# EAGLE design XJK1310-BT (EAGLE 9.6.2)
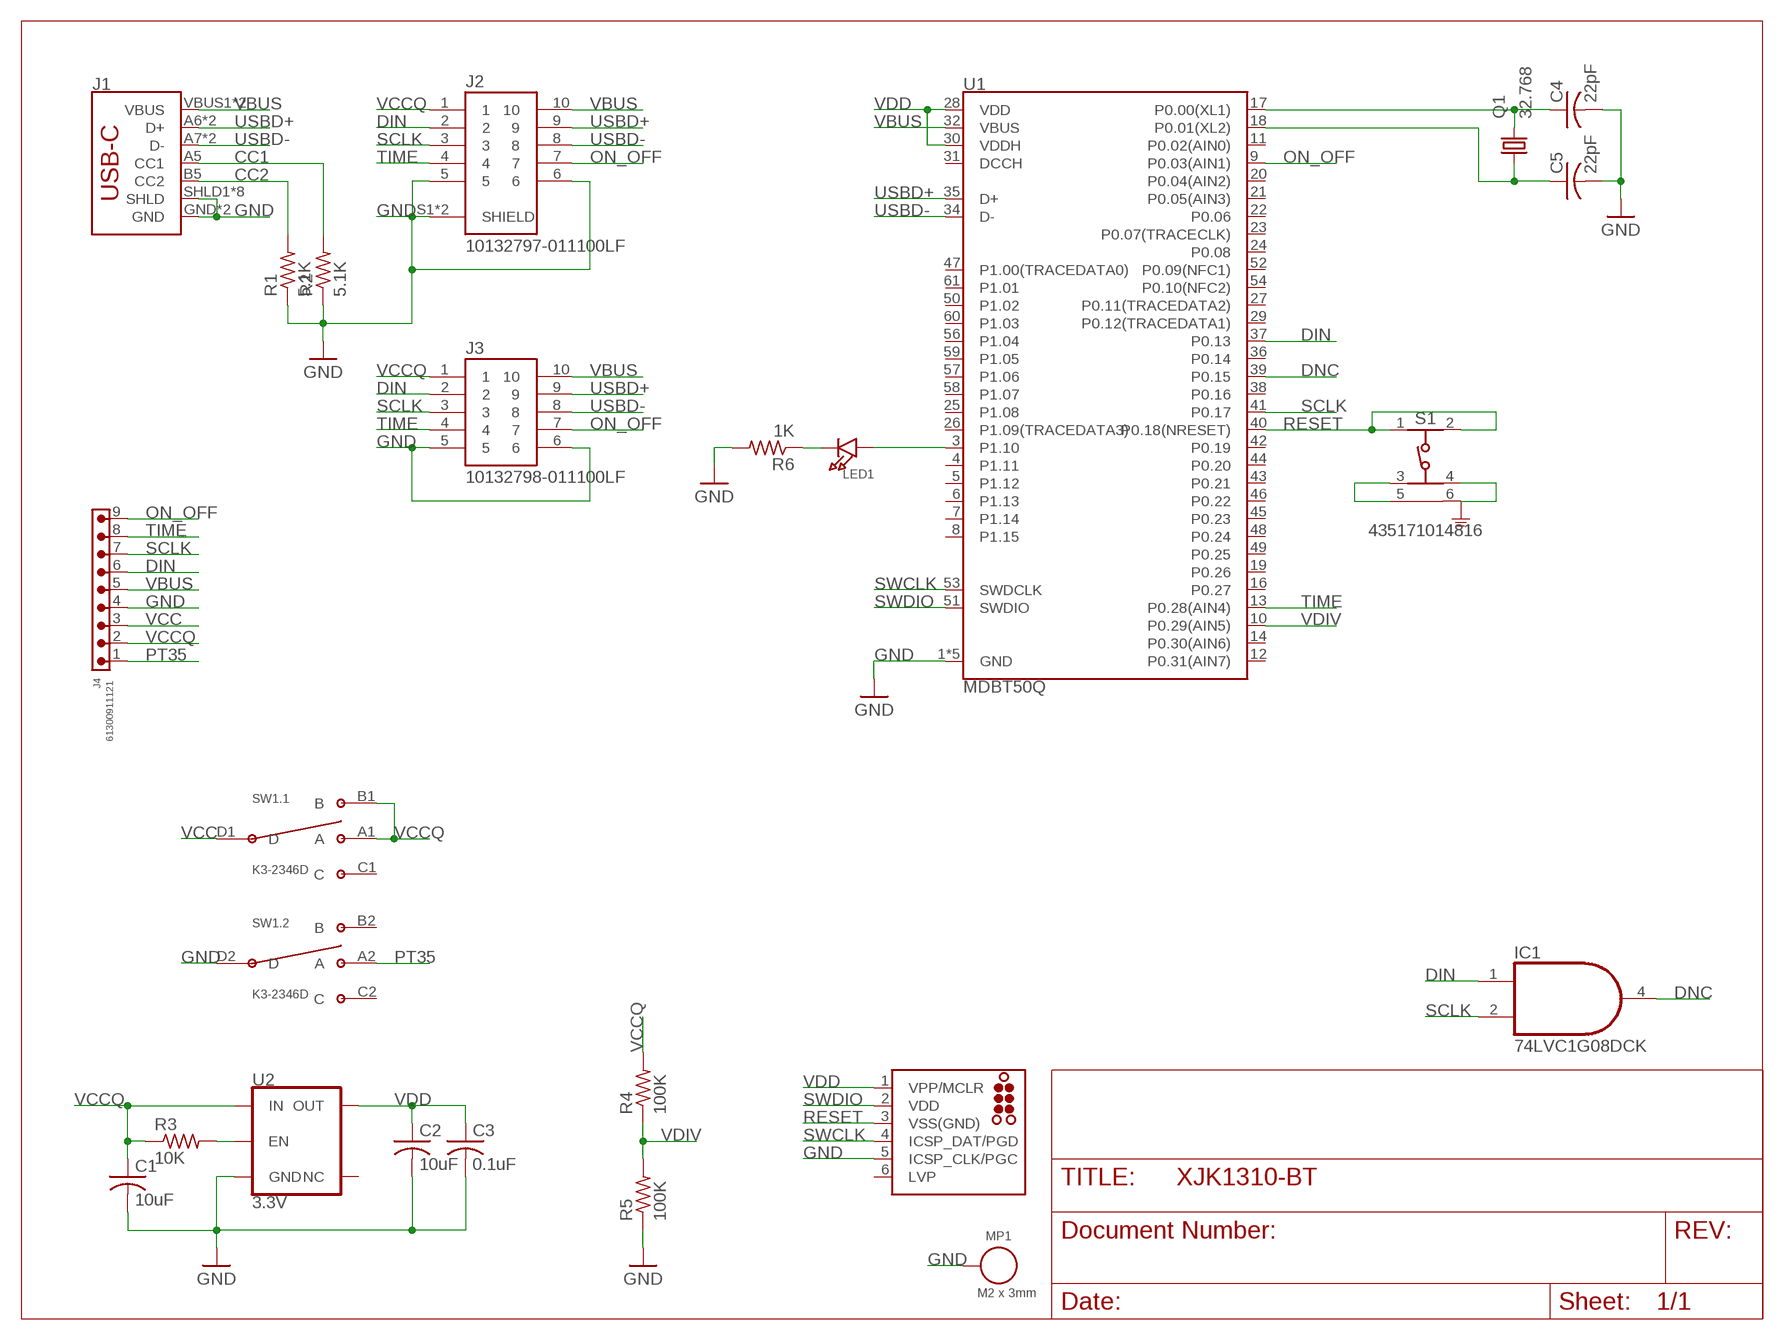
[diagram p0: schematic, sheet 1]

## Parts
C1  10uF  C-USC0603  [C0603]
C2  10uF  C-USC0603  [C0603]
C3  0.1uF  C-USC0603  [C0603]
C4  22pF  C-USC0402  [C0402]
C5  22pF  C-USC0402  [C0402]
IC1  74LVC1G08DCK  [SC70-5]
J1  USB_C5  [USB-C-16P-5]
J2  10132797-011100LF  [AMPHENOL_10132797-011100LF]
J3  10132798-011100LF  [AMPHENOL_10132798-011100LF]
J4  61300911121  6130XX11121_61300911121  [61300911121]
J5  TC2030-MCP-NL  [TC2030-MCP-NL]
LED1  LED0805_NOOUTLINE  [CHIPLED_0805_NOOUTLINE]
MP1  M2 x 3mm  WA-SMSI_9774XXX243_9774030243R  [WA-SMSI_9774030243]
Q1  32.768  KX-327-NHF  [3.2X1.5]
R1  5.1K  R-US_R0402  [R0402]
R2  5.1K  R-US_R0402  [R0402]
R3  10K  R-US_R0402  [R0402]
R4  100K  R-US_R0402  [R0402]
R5  100K  R-US_R0402  [R0402]
R6  1K  R-US_R0402  [R0402]
S1  435171014816  [435171014816]
SW1  K3-2346D  [K3-2346D]
U1  MDBT50Q  [MDBT50Q]
U2  3.3V  V_REG_AP2112K-3.3V  [SOT23-5]

## Nets
CC1: J1.A5(CC1) R2.2
CC2: J1.B5(CC2) R1.2
DIN: IC1.1(I0) J2.2 J3.2 J4.6 U1.37(P0.13)
DNC: IC1.4(O) U1.39(P0.15)
GND: C1.2 C2.2 C3.2 C4.2 C5.2 J1.GND J1.GND2(GND) J1.SHLD1(SHLD) J1.SHLD2(SHLD) J1.SHLD3(SHLD) J1.SHLD4(SHLD) J1.SHLD5(SHLD) J1.SHLD6(SHLD) J1.SHLD7(SHLD) J1.SHLD8(SHLD) J2.5 J2.6 J2.S1(SHIELD) J2.S2(SHIELD) J3.5 J3.6 J4.4 J5.5(ICSP_CLK/PGC) MP1.1 R1.1 R2.1 R5.1 R6.2 S1.3 S1.4 S1.5 S1.6 SW1.D2(.2:D) U1.1(GND) U1.2(GND) U1.15(GND) U1.33(GND) U1.55(GND) U2.2(GND)
N$1: C4.1 Q1.2 U1.17(P0.00(XL1))
N$2: C5.1 Q1.1 U1.18(P0.01(XL2))
N$3: R3.2 U2.3(EN)
N$4: LED1.A U1.3(P1.10)
N$6: LED1.C R6.1
ON_OFF: J2.7 J3.7 J4.9 U1.9(P0.03(AIN1))
PT35: J4.1 SW1.A2(.2:A)
RESET: J5.3(VSS(GND)) S1.1 S1.2 U1.40(P0.18(NRESET))
SCLK: IC1.2(I1) J2.3 J3.3 J4.7 U1.41(P0.17)
SWCLK: J5.4(ICSP_DAT/PGD) U1.53(SWDCLK)
SWDIO: J5.2(VDD) U1.51(SWDIO)
TIME: J2.4 J3.4 J4.8 U1.13(P0.28(AIN4))
USBD+: J1.A6(D+) J1.B6(D+) J2.9 J3.9 U1.35(D+)
USBD-: J1.A7(D-) J1.B7(D-) J2.8 J3.8 U1.34(D-)
VBUS: J1.VBUS1(VBUS) J1.VBUS2(VBUS) J2.10 J3.10 J4.5 U1.32(VBUS)
VCC: J4.3 SW1.D1(.1:D)
VCCQ: C1.1 J2.1 J3.1 J4.2 R3.1 R4.2 SW1.A1(.1:A) SW1.B1(.1:B) U2.1(IN)
VDD: C2.1 C3.1 J5.1(VPP/MCLR) U1.28(VDD) U1.30(VDDH) U2.5(OUT)
VDIV: R4.1 R5.2 U1.10(P0.29(AIN5))
Unconnected: J5.6(LVP) SW1.B2(.2:B) SW1.C1(.1:C) SW1.C2(.2:C) U1.4(P1.11) U1.5(P1.12) U1.6(P1.13) U1.7(P1.14) U1.8(P1.15) U1.11(P0.02(AIN0)) U1.12(P0.31(AIN7)) U1.14(P0.30(AIN6)) U1.16(P0.27) U1.19(P0.26) U1.20(P0.04(AIN2)) U1.21(P0.05(AIN3)) U1.22(P0.06) U1.23(P0.07(TRACECLK)) U1.24(P0.08) U1.25(P1.08) U1.26(P1.09(TRACEDATA3)) U1.27(P0.11(TRACEDATA2)) U1.29(P0.12(TRACEDATA1)) U1.31(DCCH) U1.36(P0.14) U1.38(P0.16) U1.42(P0.19) U1.43(P0.21) U1.44(P0.20) U1.45(P0.23) U1.46(P0.22) U1.47(P1.00(TRACEDATA0)) U1.48(P0.24) U1.49(P0.25) U1.50(P1.02) U1.52(P0.09(NFC1)) U1.54(P0.10(NFC2)) U1.56(P1.04) U1.57(P1.06) U1.58(P1.07) U1.59(P1.05) U1.60(P1.03) U1.61(P1.01) U2.4(NC)

## Power pins joined to a net without a drawn wire
GND: IC1.3(GND)
VCC: IC1.5(VCC)

## Library data of the parts
C1 C2 = rcl:C-US: CAPACITOR, American symbol; LCSC: C86275; SPICEPREFIX: C
C3 = rcl:C-US: CAPACITOR, American symbol; LCSC: C1591; SPICEPREFIX: C
C4 C5 = rcl:C-US: CAPACITOR, American symbol; LCSC: C106203; SPICEPREFIX: C
IC1 = 74xx-little-us:74*1G08: 2-input AND gate; LCSC: C7832
J1 = USBC:USB_C: USB Type C 16Pin Connector Super Speed pins not available on the 16-pin purely SMD connector so this part is best for USB 2.0 implementations. D1 and D2 are tied together enabling D+/- no matter which way the cable is plugged into the connector. The two channel configuration pins (CC1/2) are exposed. These are normally connected to ground via 5.1k resistors but can be reconfigured for high current/high power applications.; LCSC: C393939
J2 = 10132797-011100LF:10132797-011100LF: Conn Board to Board PL 10 POS 0.5mm Solder ST SMD T/R; LCSC: C3654689; MANUFACTURER: Amphenol; PARTREV: B; STANDARD: Manufacturer Recommendations
J3 = 10132798-011100LF:10132798-011100LF; LCSC: C5338055; MANUFACTURER: Amphenol; MAXIMUM_PACKAGE_HEIGHT: 2.30mm; PARTREV: F; SNAPEDA_PN: 10132798-011100LF; STANDARD: Manufacturer Recommendations
J4 = Wurth_Connectors_WR-PHD:6130XX11121_61300911121: WR-PHD 2.54 mm THT Pin Header ARTICLE PROPERTIES: Pins:1;​ 2;​ 3;​ 4;​ 5;​ 6;​ 7;​ 8;​ 9;​ 10;​ 12;​ 13;​ 14;​ 15;​ 16;​ 18;​ 20;​ 22;​ 24;​ 25;​ 32;​ 36;​ 40 KIND PROPERTIES: Pitch：2.54 mm Quality Class:3 as per CECC 75 301-802 Rows：Single Gender：Pin Header Type：Straight MATERIAL PROPERTIES: Insulator Material PA6T; PBT Insulator Flammability Rating:UL94 V-0 Contact Material:Copper Alloy Contact Plating:Gold Contact Type:Stamped GENERAL INFORMATION Operating Temperature:-40 up to +105 °C ELECTRICAL PROPERTIES: Withstanding Voltage 500 V (AC) Contact Resistance 20 mΩ RISO 1000 MΩ CERTIFICATION UL Approval:E323964 PACKAGING PROPERTIES Packaging:Bag <https://www.we-online.com/catalog/media/o33211v209%20Family_BTB_PHD_6130xx11121.jpg> Details see: https://www.we-online.com/katalog/en/em/PHD_2_54_THT_PIN_HEADER_6130XX11121 Updated by Ella Wu 2021-12-08 2021 (C) Würth Elektronik; DATASHEET-URL: https://www.we-online.com/redexpert/spec/61300911121?ae; GENDER: Pin Header; IR: 3A; MOUNT: THT; PACKAGING: Bag; PART-NUMBER: 61300911121; PINS: 9; PITCH: 2.54mm; ROWS: Single; TYPE: Straight
J5 = tag-connect:TC2030: TAG-CONNECT ICSP Connector Manufacturer: Tag-Connect <http://www.tag-connect.com> Cable for easy In-Circuit Serial Programming. Designed for Microchip ICD2, suitable for many others. Two variants - one "with legs" (for hands-free fit on PCB) and another "without legs" for quick programming. PAD Description 1 MCLR/Vpp 2 Vdd 3 GND 4 PGD (ISPDAT) 5 PGC (ISPCLK) 6 nc (used for LVP) ©2009 ROFA.cz - modified and updated by Robert Darlington ‹rdarlington@gmail.com›
LED1 = microbuilder:LED: LED 0603 - 0603 Surface Mount Package 2mA: Green LED - Low Power (3.9mcd, 2ma, 1.7Vf) - Digikey: 475-2709-2-ND Orange LED - Low Power (9.8mcd, 2ma, 1.8Vf) - Digikey: 475-1194-2-ND Red LED - Low Power (5mcd, 2ma, 1.8Vf) - Digikey: 475-1195-2-ND Yellow LED - Low Power (7mcd, 2ma, 1.8Vf) - Digikey: 475-1196-2-ND 5mA: Blue LED - Low Power (17mcd, 5ma, 2.9Vf) - Digikey: LNJ937W8CRACT-ND 0805 - 0805 Surface Mount Package 2mA: Red LED (8.8mcd, 2mA, 1.8Vf, Clear) - Low Power [Digikey: 475-2510-1-ND] Green LED (5mcd, 2mA, 1.8Vf, Clear) - Low Power [Digikey: 475-2730-1-ND] Yellow LED (11.3mcd, 2mA, 1.8Vf, Clear) - Low Power [Digikey: 475-2555-1-ND] 20mA: Red LED (104mcd, 20mA, Diffused) - LS R976 [Digikey: 475-1278-6-ND] Red LED (12mcd, 20mA, 2.0Vf, Clear) - APT2012EC [Digikey: 754-1128-1-ND] Green LED (15mcd, 20mA, 2.2Vf, Clear) - APT2012GC [Digikey: 754-1131-1-ND] Orange LED (160mcd, 20mA, 2.1Vf, Clear) - APT2012SECK [Digikey: 754-1130-1-ND] 1206 - 1206 Surface Mount Package Green LED (26mcd, 20mA, Diffused) - LG N971 [Digikey: 475-1407-6-ND] Red LED (15mcd, 20mA, Diffused) - LH N974 [Digikey: 475-1416-6-ND]; LCSC: C2297
MP1 = Wurth_Assembly_WA-SMSI:WA-SMSI_9774XXX243: WA-SMSI SMT Steel Spacer, M2 Thread Internal Applications Assembling of PCBs to housing and to other PCBs For Distances from 1 to 8 mm Fast and precise process Strong holding forces and torques Highest process reliability Instant removable Polyimide Tape Properties Material Steel Surface Tin Ti M2 Solder Paste Thickness 150 µm Tightening Torque (Value) 0.2 N*m General Information Operating Temperature -55 up to +150 °C <https://www.we-online.com/catalog/media/o92910v209%20Family_WA-SMSI_M2-M2.5.jpg> Details see: https://www.we-online.com/katalog/en/SMSI_SMT_STEEL_SPACER_M2_THREAD_INTERNAL Updated by Ella Wu 2020-06-03 2021(C) Wurth Elektronik; DATASHEET-URL: https://www.we-online.com/catalog/datasheet/9774030243R.pdf; INNER-DIAMETER: 2.8mm; INNER-THREAD-LENGTH: -; LCSC: C36498713; OUTER-DIAMETER: 4.35mm; PART-NUMBER: 9774030243R; PIN-LENGTH: 3mm; THREAD: M2
Q1 = crystal-geyer_V1_0:KX-327: Tuning Fork Crystals (kHz) SMD: KX327 - Serie Model Size l/w/h [mm] Frequency Range Frequency Stability Temp. Range [°C] Load Capacitance AECQ 200 availabel Datasheet KX-327VT KX-327FT KX-327RT KX-327NHT KX-327NHF KX-327L KX-327S 1.25/1.05/0.5 1.6/1.0/0.5 2.0/1.2/0.6 3.2/1.5/0.8 3.2/1.5/0.8 7.0/1.5/1.4 8.2/3.8/2.5 32,768 kHz 32,768 kHz 32,768 kHz 32,768 kHz 32,768 kHz 32,768 kHz 32,768 kHz ±10 … ±20ppm ±10 … ±20ppm ±10 … ±20ppm ±10 … ±20ppm ±10 … ±20ppm ±10 … ±20ppm ±5 … ±20ppm (*) -40°C …+85°C (*) -40°C …+85°C (*) -40°C …+85°C (*) -40°C …+85°C (*) -40°C …+125°C (*) -40°C …+85°C (*) -40°C …+85°C 7/9/12,5 7/9/12,5 7/9/12,6 7/9/12,5 9/12,5 7/9/12,5 6/12,5 - - - - yes - - KX-327VT.pdf <http://www.geyer-electronic.de/uploads/tx_userartikelfrequenz/GEYER-KX-327VT.pdf> KX-327FT.pdf <http://www.geyer-electronic.de/uploads/tx_userartikelfrequenz/GEYER-KX-327FT.pdf> KX-327RT.pdf <http://www.geyer-electronic.de/uploads/tx_userartikelfrequenz/GEYER-KX-327RT.pdf> KX-327NHT.pdf <http://www.geyer-electronic.de/uploads/tx_userartikelfrequenz/GEYER-KX-327NHT.pdf> KX-327NHF.pdf <http://www.geyer-electronic.de/uploads/tx_userartikelfrequenz/GEYER-KX-327NHF.pdf> KX-327L.pdf <http://www.geyer-electronic.de/uploads/tx_userartikelfrequenz/GEYER-KX-327L.pdf> KX-327S.pdf <http://www.geyer-electronic.de/uploads/tx_userartikelfrequenz/GEYER-KX-327S.pdf> <http://www.geyer-electronic.de/fileadmin/template/img/logo-geyer-electronic.png> Details see: http://www.geyer-electronic.de/Frequenz-Produkte.9.0.html Created 2016-06-07, Hans Locher 2016 (C) Geyer Quartz Technology KX327VT,KX327FT,KX327RT,KX327NHT,KX327NHF,KX327S,KX327L;125105;1610;2012;3215;7015;8238;1,25x1,05,1.25x1.05;1,6x1,0,1.6x1.0;2,0x1,2,2.0x1.2;3,2x1,5,3.2x1.5;8,2x3,8,8.2x3.8,7.0x1.5,7,0x1,532.768kHz; LCSC: C32346
R1 R2 = rcl:R-US_: RESISTOR, American symbol; LCSC: C105872; SPICEPREFIX: R
R3 = rcl:R-US_: RESISTOR, American symbol; LCSC: C60490; SPICEPREFIX: R
R4 R5 = rcl:R-US_: RESISTOR, American symbol; LCSC: C60491; SPICEPREFIX: R
R6 = rcl:R-US_: RESISTOR, American symbol; LCSC: C106235; SPICEPREFIX: R
S1 = Wurth_Switch_WS-TASV:435171014816: WS-TASV SMT Tact Switch 3.0 x 2.6 mm with ground terminal MATERIAL PROPERTIES Cover Material Stainless Steel PROPERTIES Actuator Material LCP Actuator Flammability Rating UL94 V-0 Actuator Color White;​ Salmon;​ Black Frame Material LCP Frame Flammability Rating UL94 V-0 Frame Color Black Contact Material Stainless Steel Contact Plating Silver Terminal Material Copper Alloy Terminal Plating Silver VR 12 V (DC) Contact Resistance Initial 100 mΩ Contact Resistance After Life Test 2 Ω RISO 100 MΩ Withstanding Voltage 250 V (AC) Washable No Qty. 9500 GENERAL INFORMATION Operating Temperature -40 up to +85 °C PACKAGING PROPERTIES Packaging Tape and Reel <https://katalog.we-online.com/media/images/v2/o158914v209%20WS-TASV-4351x10148xx_a.jpg> Details see: https://katalog.we-online.com/en/em/WS_TASV_SMT_TACT_SWITCH_3_x_2_6 Updated by Ella Wu 2020-11-18 2020(C) Wurth Elektronik; ACTUATOR-COLOR: Black; DATASHEET-URL: https://www.we-online.com/redexpert/spec/435171014816?ae; ELECTRICAL-LIFE: 500000Cycles; HEIGHT: 1.4mm; LCSC: C390649; LENGTH: 3mm; MOUNT: SMT; OPERATION-FORCE: 160g; PART-NUMBER: 435171014816; WIDTH: 2.6mm
SW1 = discrete:K3-2346D: K3-2346D; LCSC: C145839
U1 = nrf52840:MDBT50Q; LCSC: C5118826; PROD_ID: IC-14109
U2 = SparkFun-IC-Power:V_REG_AP2112: AP2112 - 600mA CMOS LDO Regulator w/ Enable The AP2112 is CMOS process low dropout linear regulator with enable function, the regulator delivers a guaranteed 600mA (min.) continuous load current. Features Output Voltage Accuracy: ±1.5% Output Current: 600mA (Min.) Foldback Short Current Protection: 50mA Enable Function to Turn ON/OFF VOUT Low Dropout Voltage (3.3V): 250mV (Typ.) @IOUT=600mA Excellent Load Regulation: 0.2%/A (Typ.) Excellent Line Regulation: 0.02%/V (Typ.) Low Quiescent Current: 55μA (Typ.) Low Standby Current: 0.01μA (Typ.) Low Output Noise: 50μVRMS PSRR: 100Hz -65dB, 1kHz -65dB OTSD Protection Stable with 1.0μF Flexible Cap: Ceramic, Tantalum and Aluminum Electrolytic Operation Temperature Range: -40°C to 85°C ESD: MM 400V, HBM 4000V; LCSC: C51118; PROD_ID: VREG-12457

## Board
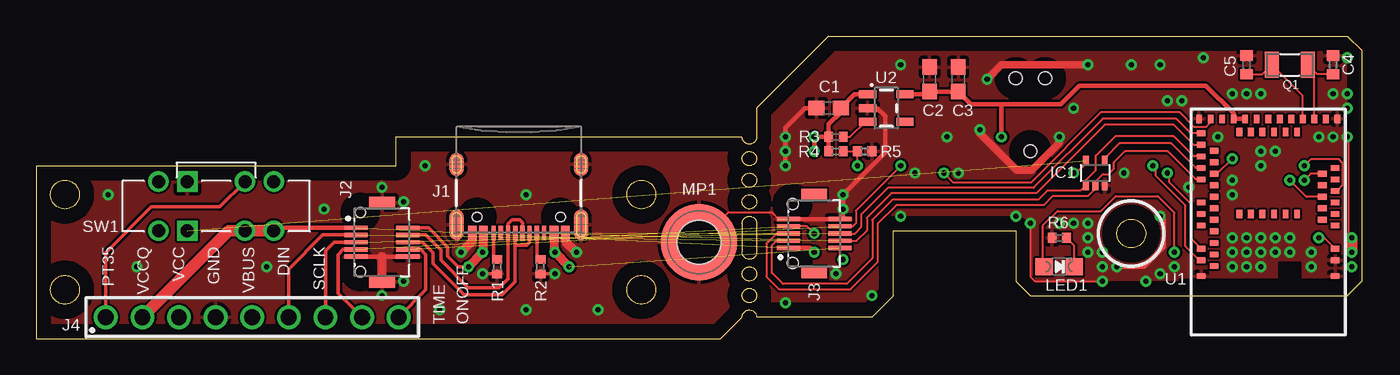
[diagram p1: board, top side]
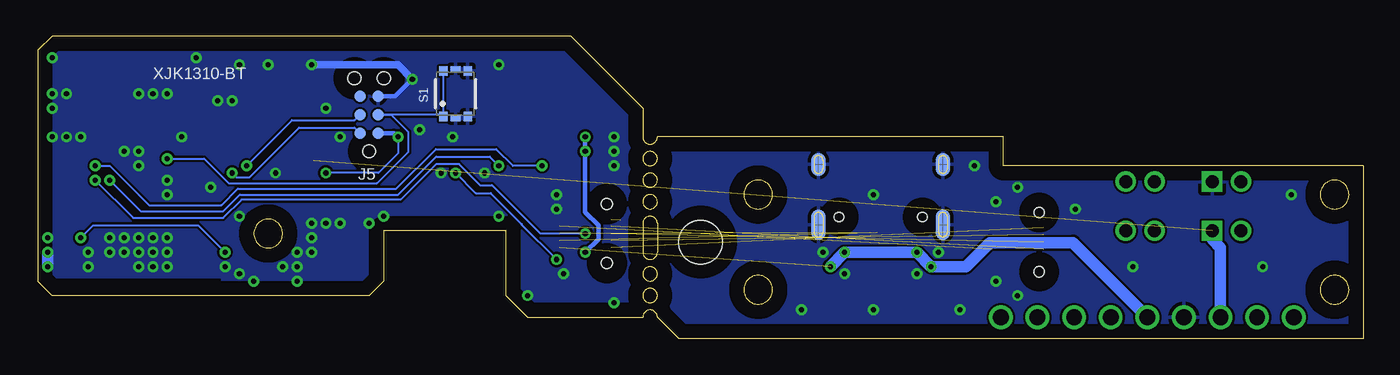
[diagram p2: board, bottom side, seen from below]

Size 92 x 21 mm. Coordinates in mm from the lower left corner, seen from the top.
Outline: 0,0 47.5,0 49,1.5 arc-180 50,1.5 58,1.5 59.5,3 59.5,7.5 68,7.5 68,4 69,3 91,3 92,4 92,20 91,21 55,21 50,16 50,14 arc-180 49,14 25,14 25,12 0,12 0,0
Outline: 41,10 arc-180 43,10 arc-180 41,10
Outline: 41,3.4 arc-180 43,3.4 arc-180 41,3.4
Outline: 1,10 arc-180 3,10 arc-180 1,10
Outline: 1,3.4 arc-180 3,3.4 arc-180 1,3.4
Outline: 75,7.3 arc-180 77,7.3 arc-180 75,7.3
Outline: 49,3 arc-180 50,3 arc-180 49,3
Outline: 49,4.5 arc-180 50,4.5 arc-180 49,4.5
Outline: 49,8 arc-180 50,8 50,6 arc-180 49,6 49,8
Outline: 49,9.5 arc-180 50,9.5 arc-180 49,9.5
Outline: 49,11 arc-180 50,11 arc-180 49,11
Outline: 49,12.5 arc-180 50,12.5 arc-180 49,12.5
Copper layers (1*16): Top 0.035mm / dielectric 1.5mm / Bottom 0.035mm
Design rules "default *": minimum track width 6mil, minimum drill 0.35mm, track to track 6mil, track to pad 6mil, pad to pad 6mil, via to via 6mil, smd to smd 6mil, copper to edge 40mil, drill to drill 6mil, minimum pad ring 10mil, minimum via ring 8mil, stop-mask expansion 4mil, vias tented up to drill 100mil, thermal gap 10mil

### Footprints (pad centres in the part's own frame; a part is rotated, then mirrored left to right if it is on the bottom)
C0603 = smd 1.1 x 1: 1 -0.85,0; 2 0.85,0
C0402 = smd 0.7 x 0.9: 1 -0.65,0; 2 0.65,0
SC70-5 = smd 0.4 x 0.7: 1 -0.65,-0.85; 2 0,-0.85; 3 0.65,-0.85; 4 0.65,0.85; 5 -0.65,0.85
USB-C-16P-5 = smd 0.3 x 1: A5 -1.25,-0.34; A6 -0.25,-0.34; A7 0.25,-0.34; A8 1.25,-0.34; B5 1.75,-0.34; B6 0.75,-0.34; B7 -0.75,-0.34; B8 -1.75,-0.34 | smd 0.6 x 1: GND -3.225,-0.34; GND2 3.225,-0.34; VBUS1 -2.45,-0.34; VBUS2 2.45,-0.34 | smd 1 x 2.1: SHLD1 -4.32,-0.915; SHLD2 4.32,-0.915 | smd 1 x 2.1 bottom: SHLD3 -4.32,-0.915; SHLD4 4.32,-0.915 | smd 1 x 1.6: SHLD5 -4.32,-5.095; SHLD8 4.32,-5.095 | smd 1 x 1.6 bottom: SHLD6 -4.32,-5.095; SHLD7 4.32,-5.095 | hole 0.65: -2.89,-1.445; 2.89,-1.445
AMPHENOL_10132797-011100LF = smd 0.3 x 1.6: 1 -1,-1.8; 2 -0.5,-1.8; 3 0,-1.8; 4 0.5,-1.8; 5 1,-1.8; 6 1,1.8; 7 0.5,1.8; 8 0,1.8; 9 -0.5,1.8; 10 -1,1.8 | smd 0.8 x 1.8: S1 -2.75,0; S2 2.75,0 | hole 0.7: -2.05,-1.5; 2.05,-1.5
AMPHENOL_10132798-011100LF = smd 0.3 x 1.6: 1 -1,1.8; 2 -0.5,1.8; 3 0,1.8; 4 0.5,1.8; 5 1,1.8; 6 1,-1.8; 7 0.5,-1.8; 8 0,-1.8; 9 -0.5,-1.8; 10 -1,-1.8 | smd 0.8 x 1.8: M1 -2.7,0; M2 2.7,0 | hole 0.75: -2.05,1.5; 2.05,1.5
61300911121 = drill 1.1: 1 -10.16,0; 2 -7.62,0; 3 -5.08,0; 4 -2.54,0; 5 0,0; 6 2.54,0; 7 5.08,0; 8 7.62,0; 9 10.16,0
TC2030-MCP-NL = smd 0.787 x 0.787: 1 1.27,-0.635; 2 1.27,0.635; 3 2.54,-0.635; 4 2.54,0.635; 5 3.81,-0.635; 6 3.81,0.635 | hole 0.889: 0,0; 5.08,-1.016; 5.08,1.016
CHIPLED_0805_NOOUTLINE = smd 1.2 x 1.2: A 0,-1.05; C 0,1.05
WA-SMSI_9774030243 = smd 5.3 x 5.3: 1 0,0 | hole 3: 0,0
3.2X1.5 = smd 1 x 1.8: 1 -1.25,0; 2 1.25,0
R0402 = smd 0.6 x 0.7: 1 -0.5,0; 2 0.5,0
435171014816 = smd 0.65 x 0.6: 1 -1.575,0.85; 2 1.575,0.85; 3 -1.575,-0.85; 4 1.575,-0.85 | smd 0.35 x 0.7: 5 -1.725,0; 6 1.725,0
K3-2346D = drill 0.9: A1 -2,1.7; A2 -2,-1.7; B1 -4,1.7; B2 -4,-1.7; C1 4,1.7; C2 4,-1.7 | drill 0.9 square: D1 2,1.7; D2 2,-1.7
MDBT50Q = smd 0.6 x 0.4: 1 -4.65,3.65; 2 -4.65,2.55; 3 -4.65,1.75; 4 -4.65,0.15; 5 -3.75,-0.25; 6 -4.65,-0.65; 7 -3.75,-1.05; 8 -4.65,-1.45; 9 -3.75,-1.85; 10 -4.65,-2.25; 11 -3.75,-2.65; 12 -4.65,-3.05; 13 -3.75,-3.45; 14 -4.65,-3.85; 34 4.65,-6.25; 35 4.65,-5.45; 36 3.75,-5.05; 37 4.65,-4.65; 38 3.75,-4.25; 39 4.65,-3.85; 40 3.75,-3.45; 41 4.65,-3.05; 42 3.75,-2.65; 43 3.75,-1.85; 44 4.65,-1.45; 45 3.75,-1.05; 46 4.65,-0.65; 47 3.75,-0.25; 48 4.65,0.15; 49 3.75,0.55; 50 3.75,1.35; 51 4.65,1.75; 52 3.75,2.15; 53 4.65,2.55; 54 3.75,2.95; 55 4.65,3.65 | smd 0.4 x 0.6: 15 -4.8,-7.25; 16 -4,-7.25; 17 -3.2,-7.25; 18 -2.4,-7.25; 19 -2,-6.35; 20 -1.6,-7.25; 21 -1.2,-6.35; 22 -0.8,-7.25; 23 -0.4,-6.35; 24 0,-7.25; 25 0.4,-6.35; 26 0.8,-7.25; 27 1.2,-6.35; 28 1.6,-7.25; 29 2,-6.35; 30 2.4,-7.25; 31 3.2,-7.25; 32 4,-7.25; 33 4.8,-7.25; 56 -2,-0.65; 57 -1.2,-0.65; 58 -0.4,-0.65; 59 0.4,-0.65; 60 1.2,-0.65; 61 2,-0.65
SOT23-5 = smd 0.55 x 1.2: 1 -0.95,-1.3; 2 0,-1.3; 3 0.95,-1.3; 4 0.95,1.3; 5 -0.95,1.3

### Placement (x,y rotation side)
C1  55,16 180 top
C2  62,18 90 top
C3  64,18 90 top
C4  90,19 90 top
C5  84,19 90 top
IC1  73.5,11.5 0 top
J1  33.5,7 180 top
J2  24,6.7 270 top
J3  54,7.3 90 top
J4  15,1.5 0 top
J5  69,13 90 bottom
LED1  71,5 270 top
MP1  46,6.7 0 top
Q1  87,19 0 top
R1  32,5 90 top
R2  35,5 90 top
R3  55.5,14 0 top
R4  55.5,13 180 top
R5  57.5,13 180 top
R6  71,7 180 top
S1  63,17 90 bottom
SW1  12.5,9.2 180 top
U1  85.5,8 180 top
U2  59,16 270 top

### Tracks (layer width: path | path; a pad name or v marks a point on that pad's centre or on a via)
CC1
  Top 0.254: J1.A5 34.75,5.75 R2.2
CC2
  Top 0.254: J1.B5 31.75,5.75 R1.2
DIN  (1 unrouted)
  Top 0.152: U1.37 80.35,12.65 78.95,14.05 74.88,14.05 73.53,12.7 73.53,11.68 72.85,11 IC1.1 72.47,10.27 70.17,10.27 69.56,9.65 59.44,9.65 58.04,8.26 58.04,5.59 56.26,3.81 51.82,3.81 51.05,4.57 51.05,6.48 51.38,6.8 J3.2
  Top 0.254: J4.6 17.54,4.84 19.9,7.2 J2.2
DNC
  Top 0.152: U1.39 80.47,11.85 78.76,13.55 75.19,13.55 74.15,12.52 IC1.4
GND  (via drill 0.35)  (1 unrouted)
  Top 0.152: 51.56,8.26 51.05,8.76 48.06,8.76 MP1.1 | v91,14 91.05,13.95 91.05,7.25 v91.3,7 | v69,8 69,4.32 69.32,4 v74,4
  Top 0.254: v31,4.5 R1.1 | v36,4.5 R2.1
  Top 0.305: J2.5 24,5.7 J2.6 | C1.2 53.37,16 52,14.63 v52,14 v52,13 v52,12 | U2.2 58.35,16 58.93,15.42 58.93,12.93 v56,10 v56,9 56,8.42 55.88,8.3 J3.6 J3.5 | v78,8.5 78.25,8.25 78.25,6.38 76.86,5 v75,5
  Top 0.508: v66,18 67,19 v73,19 | v65.5,14.5 65.5,14.25 68.06,11.68 69.09,11.68 71,13.6 v71,14
  Top 0.61: J2.S2 24,5.7 | J1.GND 36.73,6.78 v37.5,6 | J1.GND2 30.27,6.78 v29.5,6
  Top 0.813: v91.3,6 v91.3,7
  Bottom 0.305: J5.5 67.19,16.81 v66,18
  Bottom 0.508: v73,19 67,19 v66,18
  Bottom 0.813: v91.3,6 v91.3,5
  other vias: 24,3 25.5,4 25.5,9.5 24,10.5 58,3 52,2.5 61,11.5 60,19 75.5,11.5 73,8 85,13 89,14 83,6 39,2 34,2 28,2 34,10 27,12 20,9 16,5 63.2,14 80,10.5 78.5,16.5 79.5,16.5 85,12 91,17 91,19.5 78,4.5 79,5 85,7 76,19 83,17 5,10 7,5 55.5,4.5 71,8 72,8 68,8.5 73,7 73,6 74,6 74,5 77,4 90,14 81,19.5 84,17 85,17 78,19 91,16 90,17 82,14 86,13 83,11 83,10 83,7 84,7 86,7 87,7 83,5 84,6 85,5 84,5 85,6 86,6 87,6 88.5,6 88.5,5 64,11.5 60,8.5 72,16
  pour Top: 0,-1 0,12.7 8.08,20.78 91.44,20.78 92.71,19.51 92.71,1.27 90.44,-1
  pour Bottom: 0,-1 0,13.97 6.81,20.78 91.44,20.78 92.71,19.51 92.71,1.27 90.44,-1
N$1
  Top 0.152: U1.17 88.7,18.55 Q1.2 88.9,18.35 C4.1
N$2
  Top 0.152: U1.18 87.9,16.85 Q1.1 85.1,18.35 C5.1
N$3
  Top 0.152: U2.3 57.54,15.05 56.49,14 R3.2
N$4  (via drill 0.35)
  Top 0.152: v89,7 89.4,7 U1.3 | v79,6 79,8.74 77.84,9.9 74.93,9.9 73.89,8.86 70.88,8.86 69.84,7.83 69.84,5.11 LED1.A
  Bottom 0.152: v89,7 88.14,7.86 80.86,7.86 v79,6
N$6
  Top 0.152: LED1.C 72.05,6.45 R6.1
ON_OFF  (via drill 0.35)  (1 unrouted)
  Top 0.152: U1.9 88.15,9.85 v87,11 | J3.7 56.67,7.8 56.88,8.01 56.88,8.88 v60,12
  Top 0.254: J2.7 26.69,6.2 27.05,5.84 27.05,3.39 J4.9
  Bottom 0.152: v60,12 60.63,12.63 64.35,12.63 66.99,10 77.98,10 79.12,8.86 84.86,8.86 v87,11
PT35
  Top 0.254: J4.1 4.84,5.98 8,9.14 12.74,9.14 SW1.A2
RESET  (via drill 0.35)
  Top 0.152: U1.40 81.95,11.45 v83,12.5
  Bottom 0.152: v83,12.5 80.46,12.5 78.75,10.79 68.45,10.79 66.29,12.95 66.29,14.35 67.48,15.54 J5.3 63.97,15.54 S1.1 S1.2
SCLK  (1 unrouted)
  Top 0.152: J3.3 51.37,7.3 50.67,6.6 50.67,4.32 51.56,3.43 56.52,3.43 58.42,5.33 58.42,8 59.69,9.27 69.92,9.27 70.54,9.89 72.99,9.89 73.5,10.4 IC1.2 73.5,10.89 74.04,11.43 74.42,11.43 74.8,11.81 74.8,12.23 75.56,12.99 78.53,12.99 80.48,11.05 U1.41
  Top 0.254: J2.3 20.67,6.7 20.08,6.11 J4.7
SWCLK  (via drill 0.35)
  Top 0.152: U1.53 80.73,5.45 79.76,6.42 79.76,9.26 77.69,11.33 77.69,11.81 v77.5,12
  Bottom 0.152: v77.5,12 74.34,15.16 70.02,15.16 J5.4
SWDIO  (via drill 0.35)
  Top 0.152: U1.51 80.14,6.97 80.14,9.37 78.61,10.9 78.61,11.39 v78.5,11.5
  Bottom 0.152: J5.2 70.02,14.65 73.86,14.65 77.29,11.22 78.22,11.22 v78.5,11.5
TIME  (via drill 0.35)  (1 unrouted)
  Top 0.152: U1.13 88.45,11.45 v88,11 | J3.4 53.5,7.8 v54,7.3
  Top 0.254: J2.4 21.31,6.2 20.95,5.84 20.95,3.17 J4.8
  Bottom 0.152: v54,7.3 57.11,7.3 60.48,10.67 61.31,10.67 62.75,12.11 64.35,12.11 66.8,9.65 77.85,9.65 79.12,8.38 85.38,8.38 v88,11
USBD+  (1 unrouted)
  Top 0.152: U1.35 80.35,13.45 78.95,14.85 74.15,14.85 69.41,10.1 59.36,10.1 57.65,8.39 57.65,7.5 56.94,6.8 J3.9
  Top 0.254: J1.A6 33.75,8.04 33.54,8.26 33.03,8.26 32.75,7.98 J1.B6 32.75,4.17 32.14,3.56 29.97,3.56 28.09,5.44 28.09,6.14 27.03,7.2 J2.9
USBD-  (1 unrouted)
  Top 0.152: J3.8 56.82,7.3 57.27,7.75 57.27,8.64 59.1,10.47 69.22,10.47 74.01,15.27 79.12,15.27 80.14,14.25 U1.34
  Top 0.254: 33.25,6.48 33.25,3.96 32.33,3.05 29.72,3.05 27.56,5.21 27.56,5.97 26.83,6.7 J2.8 | 33.25,6.48 J1.A7 | J1.B7 34.25,6.68 34.04,6.48 33.25,6.48
VBUS  (via drill 0.35)  (1 unrouted)
  Top 0.152: v56,5.5 55.8,5.7 J3.10 | v63,11.5 63.67,10.83 69.02,10.83 73.89,15.7 79.38,15.7 80.39,14.68 81.19,14.68 81.5,15 U1.32
  Top 0.254: J2.10 27.23,7.7 28.57,6.35 28.57,5.71 29.29,5 v30,5
  Top 0.61: J1.VBUS2 31.05,6.05 v31,6 v30,5 | J1.VBUS1 35.95,6.05 v36,6 v37,5
  Bottom 0.152: v56,5.5 58.41,7.91 58.41,7.95 60.56,10.11 61.61,10.11 v63,11.5
  Bottom 0.813: J4.5 20.16,6.66 25.91,6.66 27.57,5 v30,5 v31,6 v36,6 v37,5
VCC  (1 unrouted)
  Bottom 0.813: SW1.D1 10.5,6.91 9.92,6.33 J4.3
VCCQ  (via drill 0.35)  (1 unrouted)
  Top 0.305: J2.1 16.7,7.7 SW1.B1 | U2.1 56.8,16.95 C1.1 55.85,15.72 55,14.87 R3.1 | v54,13 v54,14 R3.1 | R3.1 R4.2 | J3.1 53.7,6.3 v54,6
  Top 0.813: J4.2 13.38,7.5 SW1.A1 SW1.B1
  Bottom 0.305: v54,14 v54,13 54,8.79 53.09,7.87 53.09,6.91 v54,6
VDD  (via drill 0.35)
  Top 0.152: v72,11.5 72.21,11.5 72.9,12.19
  Top 0.305: U1.28 U1.30 83.1,15.63 81.18,17.55 72.39,17.55 71.12,16.28 67.06,16.28 | U2.5 61.8,16.95 C2.1 C3.1 64.87,16.28 67.06,16.28 | v67,14 67,16.22 67.06,16.28
  Bottom 0.152: v67,14 67,12.86 68.36,11.5 v72,11.5
  Bottom 0.305: J5.1 67.27,14.27 v67,14
VDIV  (via drill 0.35)
  Top 0.152: U1.10 90.26,10.25 90.68,10.67 90.68,12.19 90.42,12.45 88.45,12.45 v88,12 | v57,12 57,12.7 | 57,12.7 R5.2 | R4.1 56.7,13 57,12.7
  Bottom 0.152: v57,12 59.02,12 60.17,13.16 64.37,13.16 67.11,10.41 78.11,10.41 79.25,9.27 84.27,9.27 87,12 v88,12

### Text on the board
tPlace: PT35 / VCCQ / VCC / GND / VBUS / DIN / SCLK | TIME / ONOFF
bPlace: XJK1310-BT